# EAGLE design RT-Weiche8 (EAGLE 7.7.0)
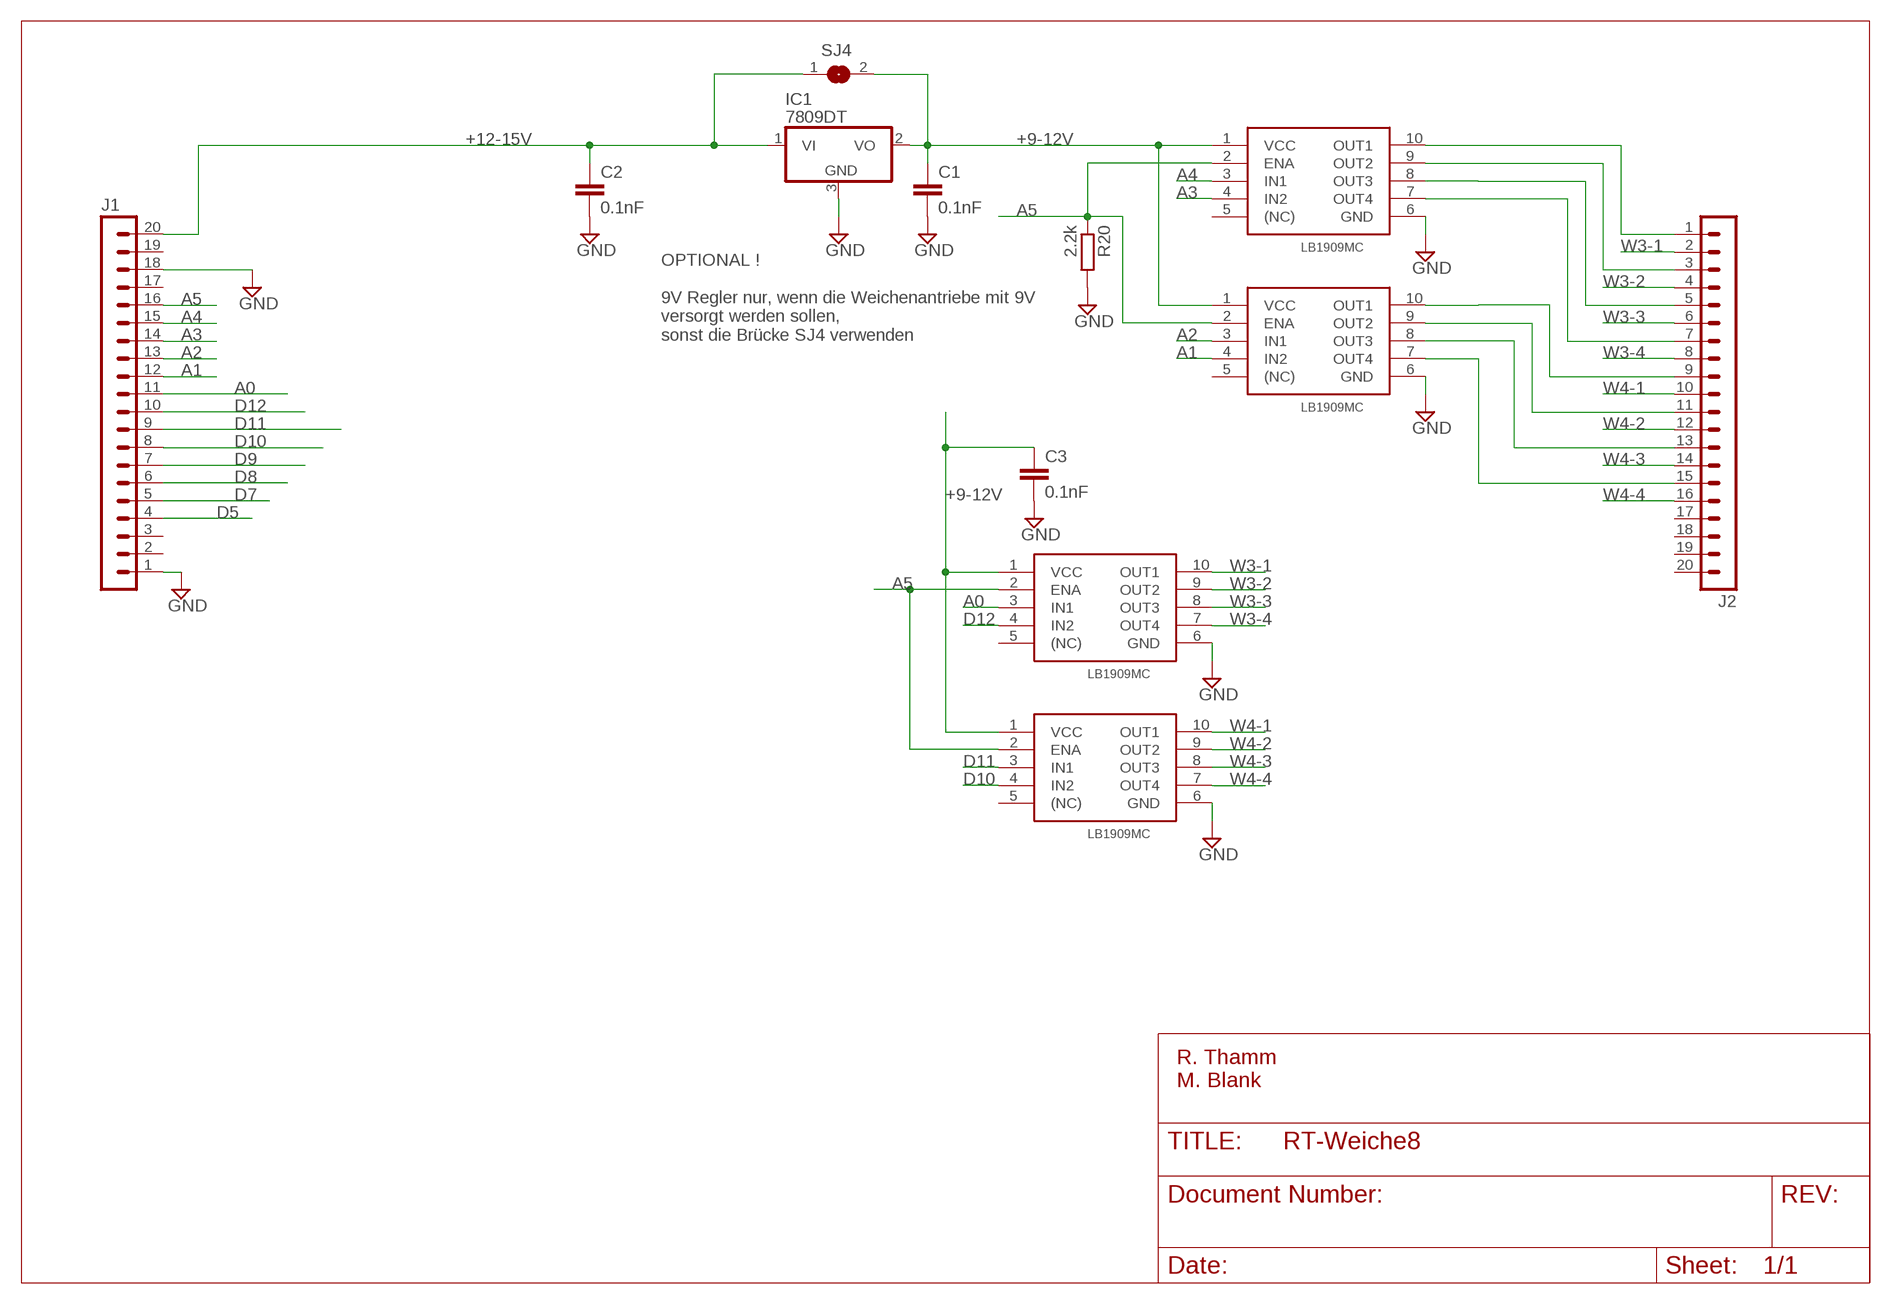
[diagram p0: schematic, sheet 1]

## Parts
C1  0.1nF  C-EUC0805K  [C0805K]
C2  0.1nF  C-EUC0805K  [C0805K]
C3  0.1nF  C-EUC0805K  [C0805K]
IC1  7809DT  7805DT  [TO252]
J1  MA20-1  [MA20-1]
J2  MA20-1  [MA20-1]
LB1909-1  LB1909MC  LB1909SOIC10  [MSOIC10-1MM]
LB1909-2  LB1909MC  LB1909SOIC10  [MSOIC10-1MM]
LB1909-3  LB1909MC  LB1909SOIC10  [MSOIC10-1MM]
LB1909-4  LB1909MC  LB1909SOIC10  [MSOIC10-1MM]
R20  2.2k  R-EU_R0805W  [R0805W]
SJ4  SJ  [SJ]

## Nets
+9-12V: C1.1 C3.1 IC1.2(VO) LB1909-1.1(VCC) LB1909-2.1(VCC) LB1909-3.1(VCC) LB1909-4.1(VCC) SJ4.2
+12-15V: C2.1 IC1.1(VI) J1.20 SJ4.1
A0: J1.11 LB1909-3.3(IN1)
A1: J1.12 LB1909-2.4(IN2)
A2: J1.13 LB1909-2.3(IN1)
A3: J1.14 LB1909-1.4(IN2)
A4: J1.15 LB1909-1.3(IN1)
A5: J1.16 LB1909-1.2(ENA) LB1909-2.2(ENA) LB1909-3.2(ENA) LB1909-4.2(ENA) R20.1
D5: J1.4
D7: J1.5
D8: J1.6
D9: J1.7
D10: J1.8 LB1909-4.4(IN2)
D11: J1.9 LB1909-4.3(IN1)
D12: J1.10 LB1909-3.4(IN2)
GND: C1.2 C2.2 C3.2 IC1.3(GND) J1.1 J1.18 LB1909-1.6(GND) LB1909-2.6(GND) LB1909-3.6(GND) LB1909-4.6(GND) R20.2
N$5: J2.9 LB1909-2.10(OUT1)
N$7: J2.13 LB1909-2.8(OUT3)
N$9: J2.1 LB1909-1.10(OUT1)
N$17: J2.15 LB1909-2.7(OUT4)
N$19: J2.3 LB1909-1.9(OUT2)
N$23: J2.5 LB1909-1.8(OUT3)
N$24: J2.7 LB1909-1.7(OUT4)
N$27: J2.11 LB1909-2.9(OUT2)
W3-1: J2.2 LB1909-3.10(OUT1)
W3-2: J2.4 LB1909-3.9(OUT2)
W3-3: J2.6 LB1909-3.8(OUT3)
W3-4: J2.8 LB1909-3.7(OUT4)
W4-1: J2.10 LB1909-4.10(OUT1)
W4-2: J2.12 LB1909-4.9(OUT2)
W4-3: J2.14 LB1909-4.8(OUT3)
W4-4: J2.16 LB1909-4.7(OUT4)
Unconnected: J1.2 J1.3 J1.17 J1.19 J2.17 J2.18 J2.19 J2.20 LB1909-1.5((NC)) LB1909-2.5((NC)) LB1909-3.5((NC)) LB1909-4.5((NC))

## Notes on the sheet
- OPTIONAL !
  
  9V Regler nur, wenn die Weichenantriebe mit 9V 
  versorgt werden sollen, 
  sonst die Brücke SJ4 verwenden
- R. Thamm                
  M. Blank

## Library data of the parts
C1-C3 = rcl:C-EU: CAPACITOR, European symbol
IC1 = adafruit:78*: Positive VOLTAGE REGULATOR Added bigger pads to the TO-92 package
J1 J2 = con-lstb:MA20-1: PIN HEADER; OC_FARNELL: unknown; OC_NEWARK: unknown
LB1909-1-LB1909-4 = lb1909:LB1909: LB1909MC Motor Driver
R20 = resistor:R-EU_: RESISTOR, European symbol
SJ4 = jumper:SJ: SMD solder JUMPER

## Board
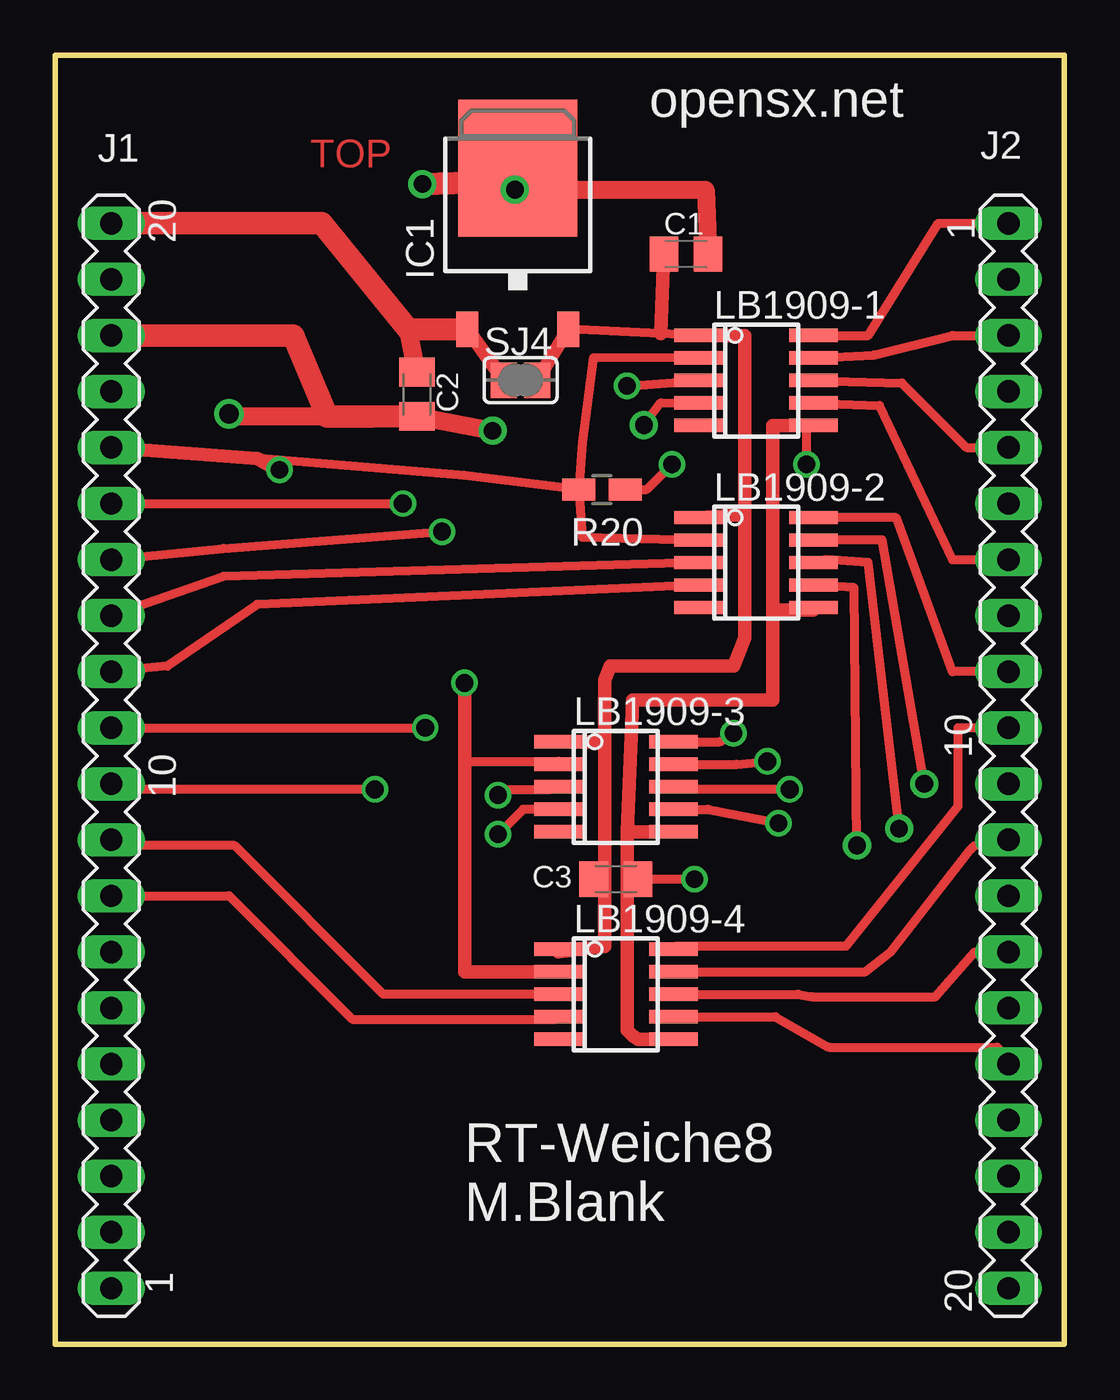
[diagram p1: board, top side]
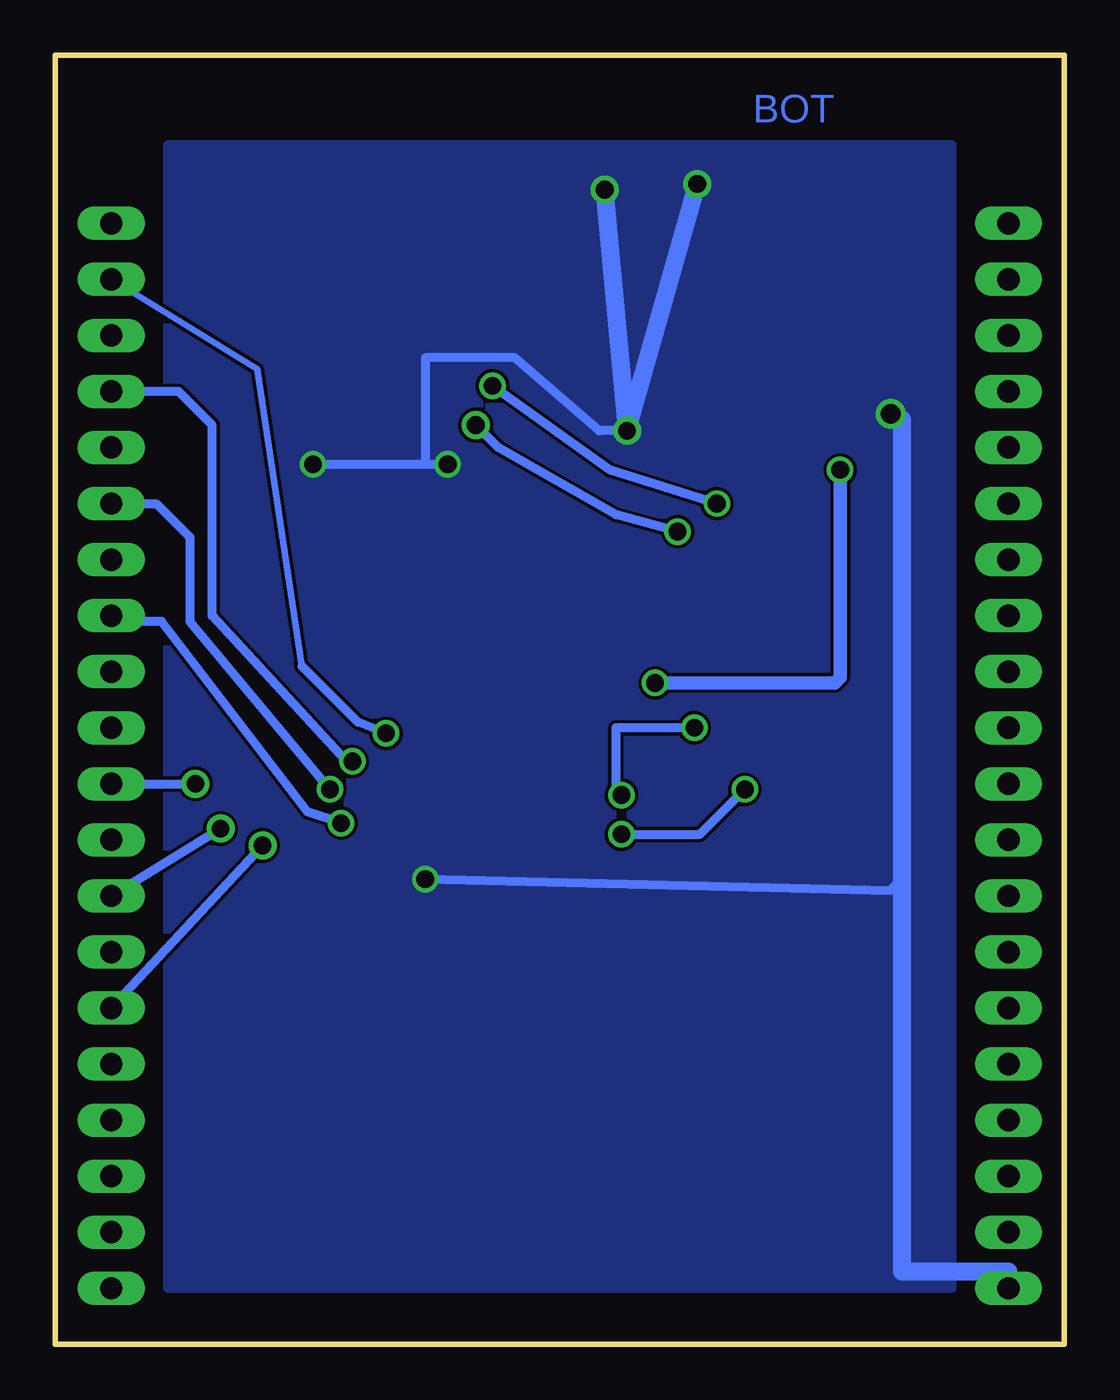
[diagram p2: board, bottom side, seen from below]

Size 45.72 x 58.42 mm. Coordinates in mm from the lower left corner, seen from the top.
Outline: 0,0 45.72,0 45.72,58.42 0,58.42 0,0
Copper layers (1*16): Top 0.018mm / dielectric 1.55mm / Bottom 0.018mm
Design rules "eC_2Layer_PClass6_BaseCopperO18_eCDefault": minimum track width 0.15mm, minimum drill 0.35mm, track to track 0.15mm, track to pad 0.15mm, pad to pad 0.15mm, via to via 0.15mm, smd to smd 0mil, copper to edge 0.25mm, drill to drill 0.35mm, minimum pad ring 0.175mm, minimum via ring 0.125mm, stop-mask expansion 0mil, vias tented up to drill 0.45mm, thermal gap 0.2mm

### Footprints (pad centres in the part's own frame; a part is rotated, then mirrored left to right if it is on the bottom)
C0805K = smd 1.3 x 1.6: 1 -1,0; 2 1,0
TO252 = smd 1 x 1.6: 1 -2.28,-4.8; 2 2.28,-4.8 | smd 5.4 x 6.2: 3 0,2.5
MA20-1 = drill 1.016 long: 1 -24.13,0; 2 -21.59,0; 3 -19.05,0; 4 -16.51,0; 5 -13.97,0; 6 -11.43,0; 7 -8.89,0; 8 -6.35,0; 9 -3.81,0; 10 -1.27,0; 11 1.27,0; 12 3.81,0; 13 6.35,0; 14 8.89,0; 15 11.43,0; 16 13.97,0; 17 16.51,0; 18 19.05,0; 19 21.59,0; 20 24.13,0
MSOIC10-1MM = smd 0.6 x 2.2: 1 -1.905,-2.6; 2 -0.885,-2.6; 3 0.135,-2.6; 4 1.155,-2.6; 5 2.175,-2.6; 6 2.175,2.6; 7 1.155,2.6; 8 0.135,2.6; 9 -0.885,2.6; 10 -1.905,2.6
R0805W = smd 1.5 x 1: 1 -1.052,0; 2 1.052,0
SJ = smd 1.168 x 1.6: 1 -0.762,0; 2 0.762,0

### Placement (x,y rotation side)
C1  28.57,49.4 0 top
C2  16.38,43.05 270 top
C3  25.4,21.08 0 top
IC1  20.95,50.8 0 top
J1  2.54,26.67 90 top
J2  43.18,26.67 270 top
LB1909-1  31.75,43.81 270 top
LB1909-2  31.75,35.56 270 top
LB1909-3  25.4,25.4 270 top
LB1909-4  25.4,16 270 top
R20  24.77,38.73 0 top
SJ4  21.08,43.69 0 top

### Tracks (layer width: path | path; a pad name or v marks a point on that pad's centre or on a via)
+9-12V
  Top 0.406: LB1909-1.1 27.44,45.8 IC1.2 | C3.1 24.89,20.57
  Top 0.61: LB1909-1.1 31.24,45.72 31.24,37.59 | 31.24,37.59 LB1909-2.1 | C1.1 27.44,45.8 | SJ4.2 IC1.2 | 24.89,27.3 24.89,20.57 24.89,18.03 22.8,17.78 LB1909-4.1 | LB1909-3.1 24.89,27.3 | 24.89,27.3 24.89,30.1 25.15,30.73 30.73,30.73 31.24,32 31.24,37.59
+12-15V
  Top 0.61: SJ4.1 IC1.1
  Top 0.813: C2.1 16,45.97
  Top 1.016: J1.20 12.06,50.8 16,45.97 IC1.1
A0  (via drill 0.8)
  Top 0.406: J1.11 v16.76,27.94 | v20.07,24.89 20.07,25.15 22.41,25.15 LB1909-3.3
  Bottom 0.406: v16.76,27.94 20.32,27.94 20.32,25.15 v20.07,24.89
A1
  Top 0.406: LB1909-2.4 9.14,33.53 5.08,30.73 J1.12
A2
  Top 0.406: LB1909-2.3 7.62,34.8 J1.13
A3  (via drill 0.8, 0.8 pad 1.27)
  Top 0.406: J1.14 7.62,36.07 v17.53,36.83 | v26.67,41.66 27.43,42.67 LB1909-1.4
  Bottom 0.406: v17.53,36.83 20.32,37.59 25.65,40.64 v26.67,41.66
A4  (via drill 0.8)
  Top 0.406: J1.15 v15.75,38.1 | v25.91,43.43 LB1909-1.3
  Bottom 0.406: v15.75,38.1 20.57,39.62 v25.91,43.43
A5  (via drill 0.8)
  Top 0.406: LB1909-1.2 24.38,44.7 23.88,40.89 R20.1 | R20.1 18.54,39.37 3.3,40.64 J1.16 | R20.1 23.88,36.58 LB1909-2.2 | 18.54,26.42 22.8,26.42 LB1909-3.2
  Top 0.61: LB1909-4.2 18.54,16.89 18.54,26.42 v18.54,29.97 | J1.16 9.14,40.13 v10.16,39.62
  Bottom 0.61: v10.16,39.62 10.16,30.23 10.41,29.97 v18.54,29.97
D10
  Top 0.406: J1.8 7.87,20.32 13.46,14.73 22.68,14.73 LB1909-4.4
D11
  Top 0.406: LB1909-4.3 14.87,15.87 8.13,22.61 2.79,22.61 J1.9
D12  (via drill 0.8)
  Top 0.406: LB1909-3.4 21.2,24.25 v20.07,23.11 | v14.48,25.15 2.79,25.15 J1.10
  Bottom 0.406: v20.07,23.11 16.51,23.11 v14.48,25.15
GND  (via drill 0.8, 0.8 pad 1.27, 0.9)
  Top 0.406: R20.2 26.8,38.73 v27.94,39.88 | v34.04,39.88 34.04,41.39 33.78,41.64 | C3.2 v28.96,21.08
  Top 0.61: LB1909-1.6 33.78,41.64 32.51,41.64 32.51,33.27 | 32.51,33.27 34.35,33.27 LB1909-2.6 | LB1909-3.6 25.91,23.23 | 25.91,23.23 26.16,29.21 32.51,29.21 32.51,33.27 | LB1909-4.6 26.42,13.83 26.16,13.97 25.91,14.22 25.91,23.23
  Top 0.813: C2.2 v19.81,41.4 | v20.83,52.32 29.46,52.32 C1.2 | 12.32,42.04 7.87,42.04 v7.87,42.16
  Top 1.016: v16.64,52.58 20.95,52.7 IC1.3 | J1.18 10.79,45.72 12.32,42.04 14.35,42.04 C2.2
  Bottom 0.406: v27.94,39.88 28.96,39.88 | 28.96,39.88 v34.04,39.88 | v19.81,41.4 21.08,41.4 24.89,44.7 28.96,44.7 28.96,39.88 | v28.96,21.08 7.87,20.57 7.37,21.08
  Bottom 0.813: v16.64,52.58 v19.81,41.4 v20.83,52.32 | v7.87,42.16 7.37,41.91 7.37,21.08 7.37,3.3 2.54,3.3 J1.1
  pour Bottom: 5.08,54.36 40.64,54.36 40.64,2.54 5.08,2.54
N$5
  Top 0.406: J2.9 40.64,30.48 38.1,37.47 LB1909-2.10
N$7  (via drill 0.8 pad 1.27)
  Top 0.406: v38.23,23.37 36.83,35.43 34.92,35.56 LB1909-2.8
  Bottom 0.406: J2.13 v38.23,23.37
N$9
  Top 0.406: LB1909-1.10 36.83,45.72 40.01,50.8 J2.1
N$17  (via drill 0.8 pad 1.27)
  Top 0.406: v36.32,22.61 36.2,34.29 LB1909-2.7
  Bottom 0.406: J2.15 v36.32,22.61
N$19
  Top 0.406: LB1909-1.9 37.08,44.83 40.64,45.72 J2.3
N$23
  Top 0.406: LB1909-1.8 38.35,43.56 41.27,40.64 J2.5
N$24
  Top 0.406: LB1909-1.7 37.34,42.55 40.64,35.56 J2.7
N$27  (via drill 0.8 pad 1.27)
  Top 0.406: v39.37,25.4 37.47,36.45 LB1909-2.9
  Bottom 0.406: J2.11 v39.37,25.4
W3-1  (via drill 0.8)
  Top 0.406: LB1909-3.10 30.1,27.3 v30.73,27.69
  Bottom 0.305: J2.2 36.58,44.2 34.54,30.73
  Bottom 0.406: v30.73,27.69 32,28.19 34.54,30.73
W3-2  (via drill 0.8)
  Top 0.406: LB1909-3.9 30.86,26.29 v32.26,26.42
  Bottom 0.406: v32.26,26.42 32.51,26.42 38.61,33.02 38.61,41.66 40.13,43.18 J2.4
W3-3  (via drill 0.8)
  Top 0.406: v33.27,25.15 28.12,25.15 LB1909-3.8
  Bottom 0.406: J2.6 41.15,38.1 39.62,36.58 39.62,32.77 v33.27,25.15
W3-4  (via drill 0.8)
  Top 0.406: LB1909-3.7 29.58,24.25 v32.77,23.62
  Bottom 0.406: v32.77,23.62 34.29,24.13 40.89,32.77 43.43,32.77 43.69,33.02 J2.8
W4-1
  Top 0.406: J2.10 40.89,27.94 40.89,24.38 35.81,18.03 28.13,18.03 LB1909-4.10
W4-2
  Top 0.406: LB1909-4.9 36.7,16.89 37.85,17.78 41.4,22.35 41.66,22.61 J2.12
W4-3
  Top 0.406: LB1909-4.8 33.65,15.87 34.29,15.75 39.88,15.75 41.66,17.78 J2.14
W4-4
  Top 0.406: LB1909-4.7 32.63,14.85 35.05,13.46 42.67,13.46 43.69,12.45 43.43,12.45 J2.16

### Text on the board
Top: TOP
Bottom: BOT
tNames: opensx.net | RT-Weiche8 / M.Blank